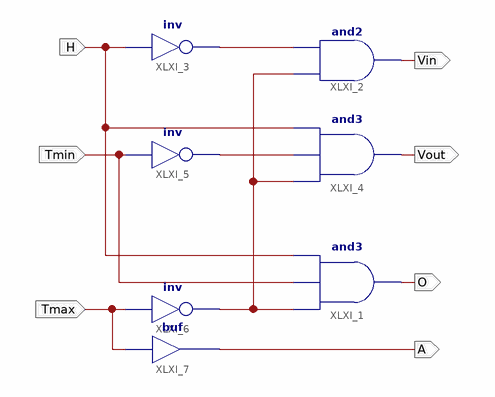
[diagram p0: schematic sheet 1]
// Xilinx ISE schematic ukol3.sch (spartan3) as structural Verilog: 7 symbols, 7 ports
module ukol3 (
  input  H,
  input  Tmin,
  input  Tmax,
  output O,
  output Vout,
  output Vin,
  output A
);

  wire XLXN_4, XLXN_5, XLXN_7;

  and XLXI_1 (O, XLXN_7, Tmin, H);
  and XLXI_2 (Vin, XLXN_7, XLXN_4);
  not XLXI_3 (XLXN_4, H);
  and XLXI_4 (Vout, XLXN_7, XLXN_5, H);
  not XLXI_5 (XLXN_5, Tmin);
  not XLXI_6 (XLXN_7, Tmax);
  buf XLXI_7 (A, Tmax);
endmodule
